# Altium schematic sheet fillcap_amp.SchDoc: Amplifier
size A3; DrawnBy: daniw / ninux; Organization: HSLU T&A; Address1: Abteilung Elektrotechnik; Address2: Technikumsstrasse 21; Address3: CH-6048 Horw; SheetNumber: 4; SheetTotal: 9; Projektname: fillcap
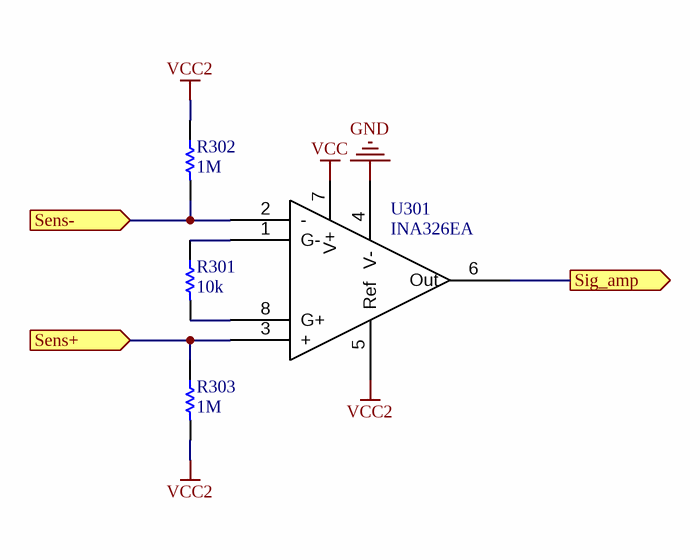
[diagram p0: fillcap_amp.SchDoc]

## Parts
R301  10k  [ERA-0805]
R302  1M  [ERA-0805]
R303  1M  [ERA-0805]
U301  INA326EA  [VSSOP8(0.65mm)]

## Ports
Sens+ (in), Sens- (in), Sig_amp (out)

## Nets
GND: U301.4(V-)
VCC: U301.7(V+)
VCC2: R302.1 R303.2 U301.5(Ref)
Sens+: R303.1 U301.3(+) ; port Sens+
Sens-: R302.2 U301.2(-) ; port Sens-
Sig_amp: U301.6(Out) ; port Sig_amp
NetR301_1: R301.1 U301.1(G-)
NetR301_2: R301.2 U301.8(G+)

## Notes on the sheet
- Project:
- Drawn by:
- Size:
- Sheet
- A3
- Rev.:
- of
- Date:
- File:

## Library data of the parts
R301-R303 = ERAS: Metal Film Thermosensitive Chip Resistor, 0.56 Ohm to 10k Ohm Range, 5% Tolerance, 0805 Size, 0.1 W; Note: If flow soldering, adjust pad width of PCB Footprint to 0.7 - 0.8 times the width of the resistor.; Published: 17-Dec-2003; LatestRevisionDate: 19-Mar-2004; LatestRevisionNote: Silkscreen size reduced.; PackageDocument: Mar-2003; PackageReference: ERA-0805; Publisher: Altium Limited; Code_IPC: 2012 [0805]; ComponentLink1Description: Manufacturer Link; ComponentLink1URL: http://www.panasonic.com/industrial/components/resistive_products.htm; ComponentLink2Description: Datasheet; ComponentLink2URL: http://www.panasonic.com/industrial/components/pdf/AOF0000CE1.pdf